# EAGLE schematic NightLightTimer (EAGLE 7.7.0)
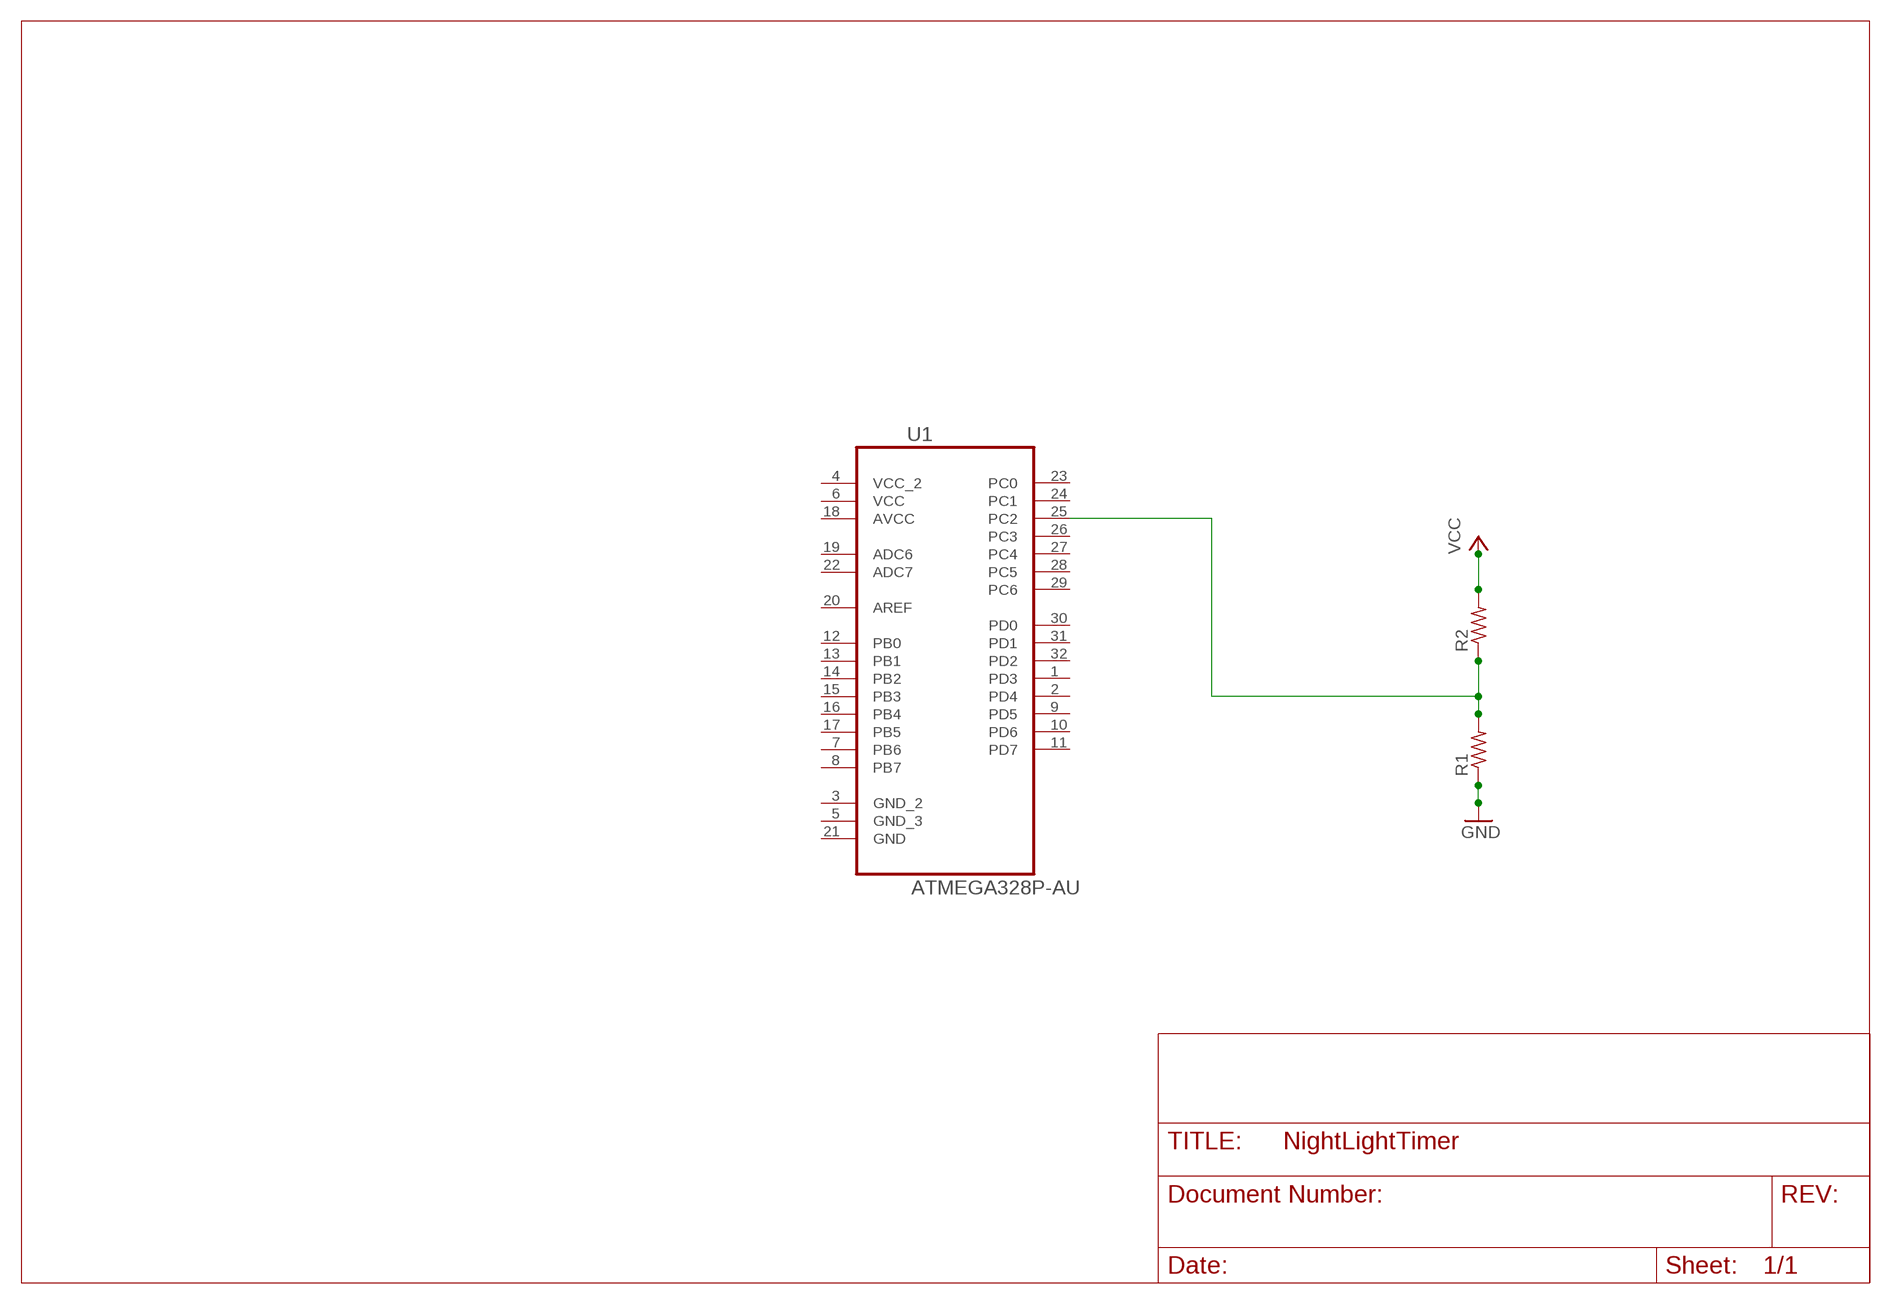
[diagram p0: schematic, sheet 1]

## Parts
R1  R-US_0204/5  [0204/5]
R2  R-US_0207/7  [0207/7]
U1  ATMEGA328P-AU  [QFP80P900X900X120-32N]

## Nets
GND: R1.1
LIGHT_SENSOR: R1.2 R2.1 U1.25(PC2)
VCC: R2.2
Unconnected: U1.1(PD3) U1.2(PD4) U1.3(GND_2) U1.5(GND_3) U1.7(PB6) U1.8(PB7) U1.9(PD5) U1.10(PD6) U1.11(PD7) U1.12(PB0) U1.13(PB1) U1.14(PB2) U1.15(PB3) U1.16(PB4) U1.17(PB5) U1.19(ADC6) U1.20(AREF) U1.21(GND) U1.22(ADC7) U1.23(PC0) U1.24(PC1) U1.26(PC3) U1.27(PC4) U1.28(PC5) U1.29(PC6) U1.30(PD0) U1.31(PD1) U1.32(PD2)

## Power pins joined to a net without a drawn wire
AVCC: U1.18(AVCC)
VCC: U1.6(VCC)
VCC_2: U1.4(VCC_2)

## Library data of the parts
R1 R2 = resistor:R-US_: RESISTOR, American symbol
U1 = Atmel_By_element14_Batch_1-00:ATMEGA328P-AU: 8-bit Microcontroller with In-System Programmable Flash; MPN: ATMEGA328P-AU; OC_FARNELL: 1715486; OC_NEWARK: 14R4631; PACKAGE: TQFP-32; SUPPLIER: Atmel